# Altium schematic sheet fuente.SchDoc
size A4
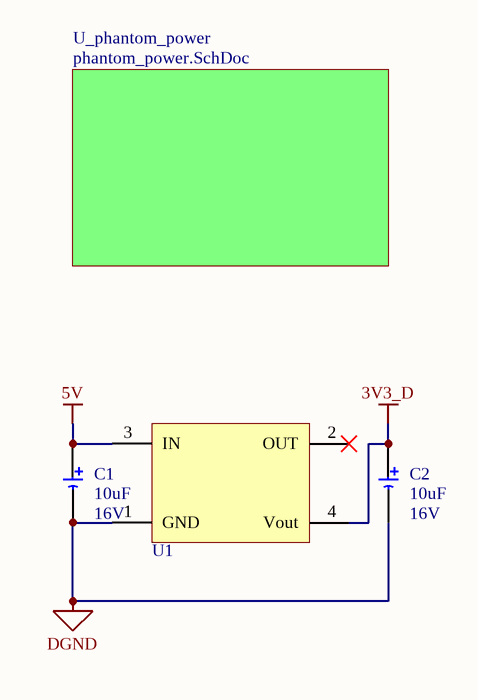
[diagram p0: fuente.SchDoc]

## Parts
C1  Valor: 10uF  tension: 16V  [CAP_Electrolytic]  (hidden comment: Capacitor polarizado)
C2  Valor: 10uF  tension: 16V  [CAP_Electrolytic]  (hidden comment: Capacitor polarizado)
U1  LM1117  [SOT223]  (value not drawn)

## Sub-sheets
U_phantom_power = phantom_power.SchDoc: no entries

## Nets
3V3_D: C2.1 U1.4(Vout)
5V: C1.1 U1.3(IN)
DGND: C1.2 C2.2 U1.1(GND)

Not connected (* = marked no-connect by the designer): U1 2(OUT)*

## Library data of the parts
U1 = LM1117: LDO Regulator; Cod. Proveedor: LM1117IMP-ADJ/NOPBCT-ND; Proveedor: Digi-Key; Encapsulado: SOT-223-4; Fabricante: Texas Instruments; Link: https://www.digikey.com/product-detail/es/LM1117IMP-ADJ-NOPB/LM1117IMP-ADJ-NOPBCT-ND/483060?utm_campaign=buynow&WT.z_cid=ref_octopart_dkc_buynow&utm_medium=aggregator&curr=usd&site=us&utm_source=octopart
C1 C2 = Capacitor polarizado: Link: *; Fabricante: *